# EasyEDA schematic Launchpad_2021-03-10.json
TITLE: Launchpad; REV: 1.0; Date: 2021-03-03; Sheet: 1/1; Drawn By: วิศรุต วงตา; Company: CYBMCYSSBSSNTMMC
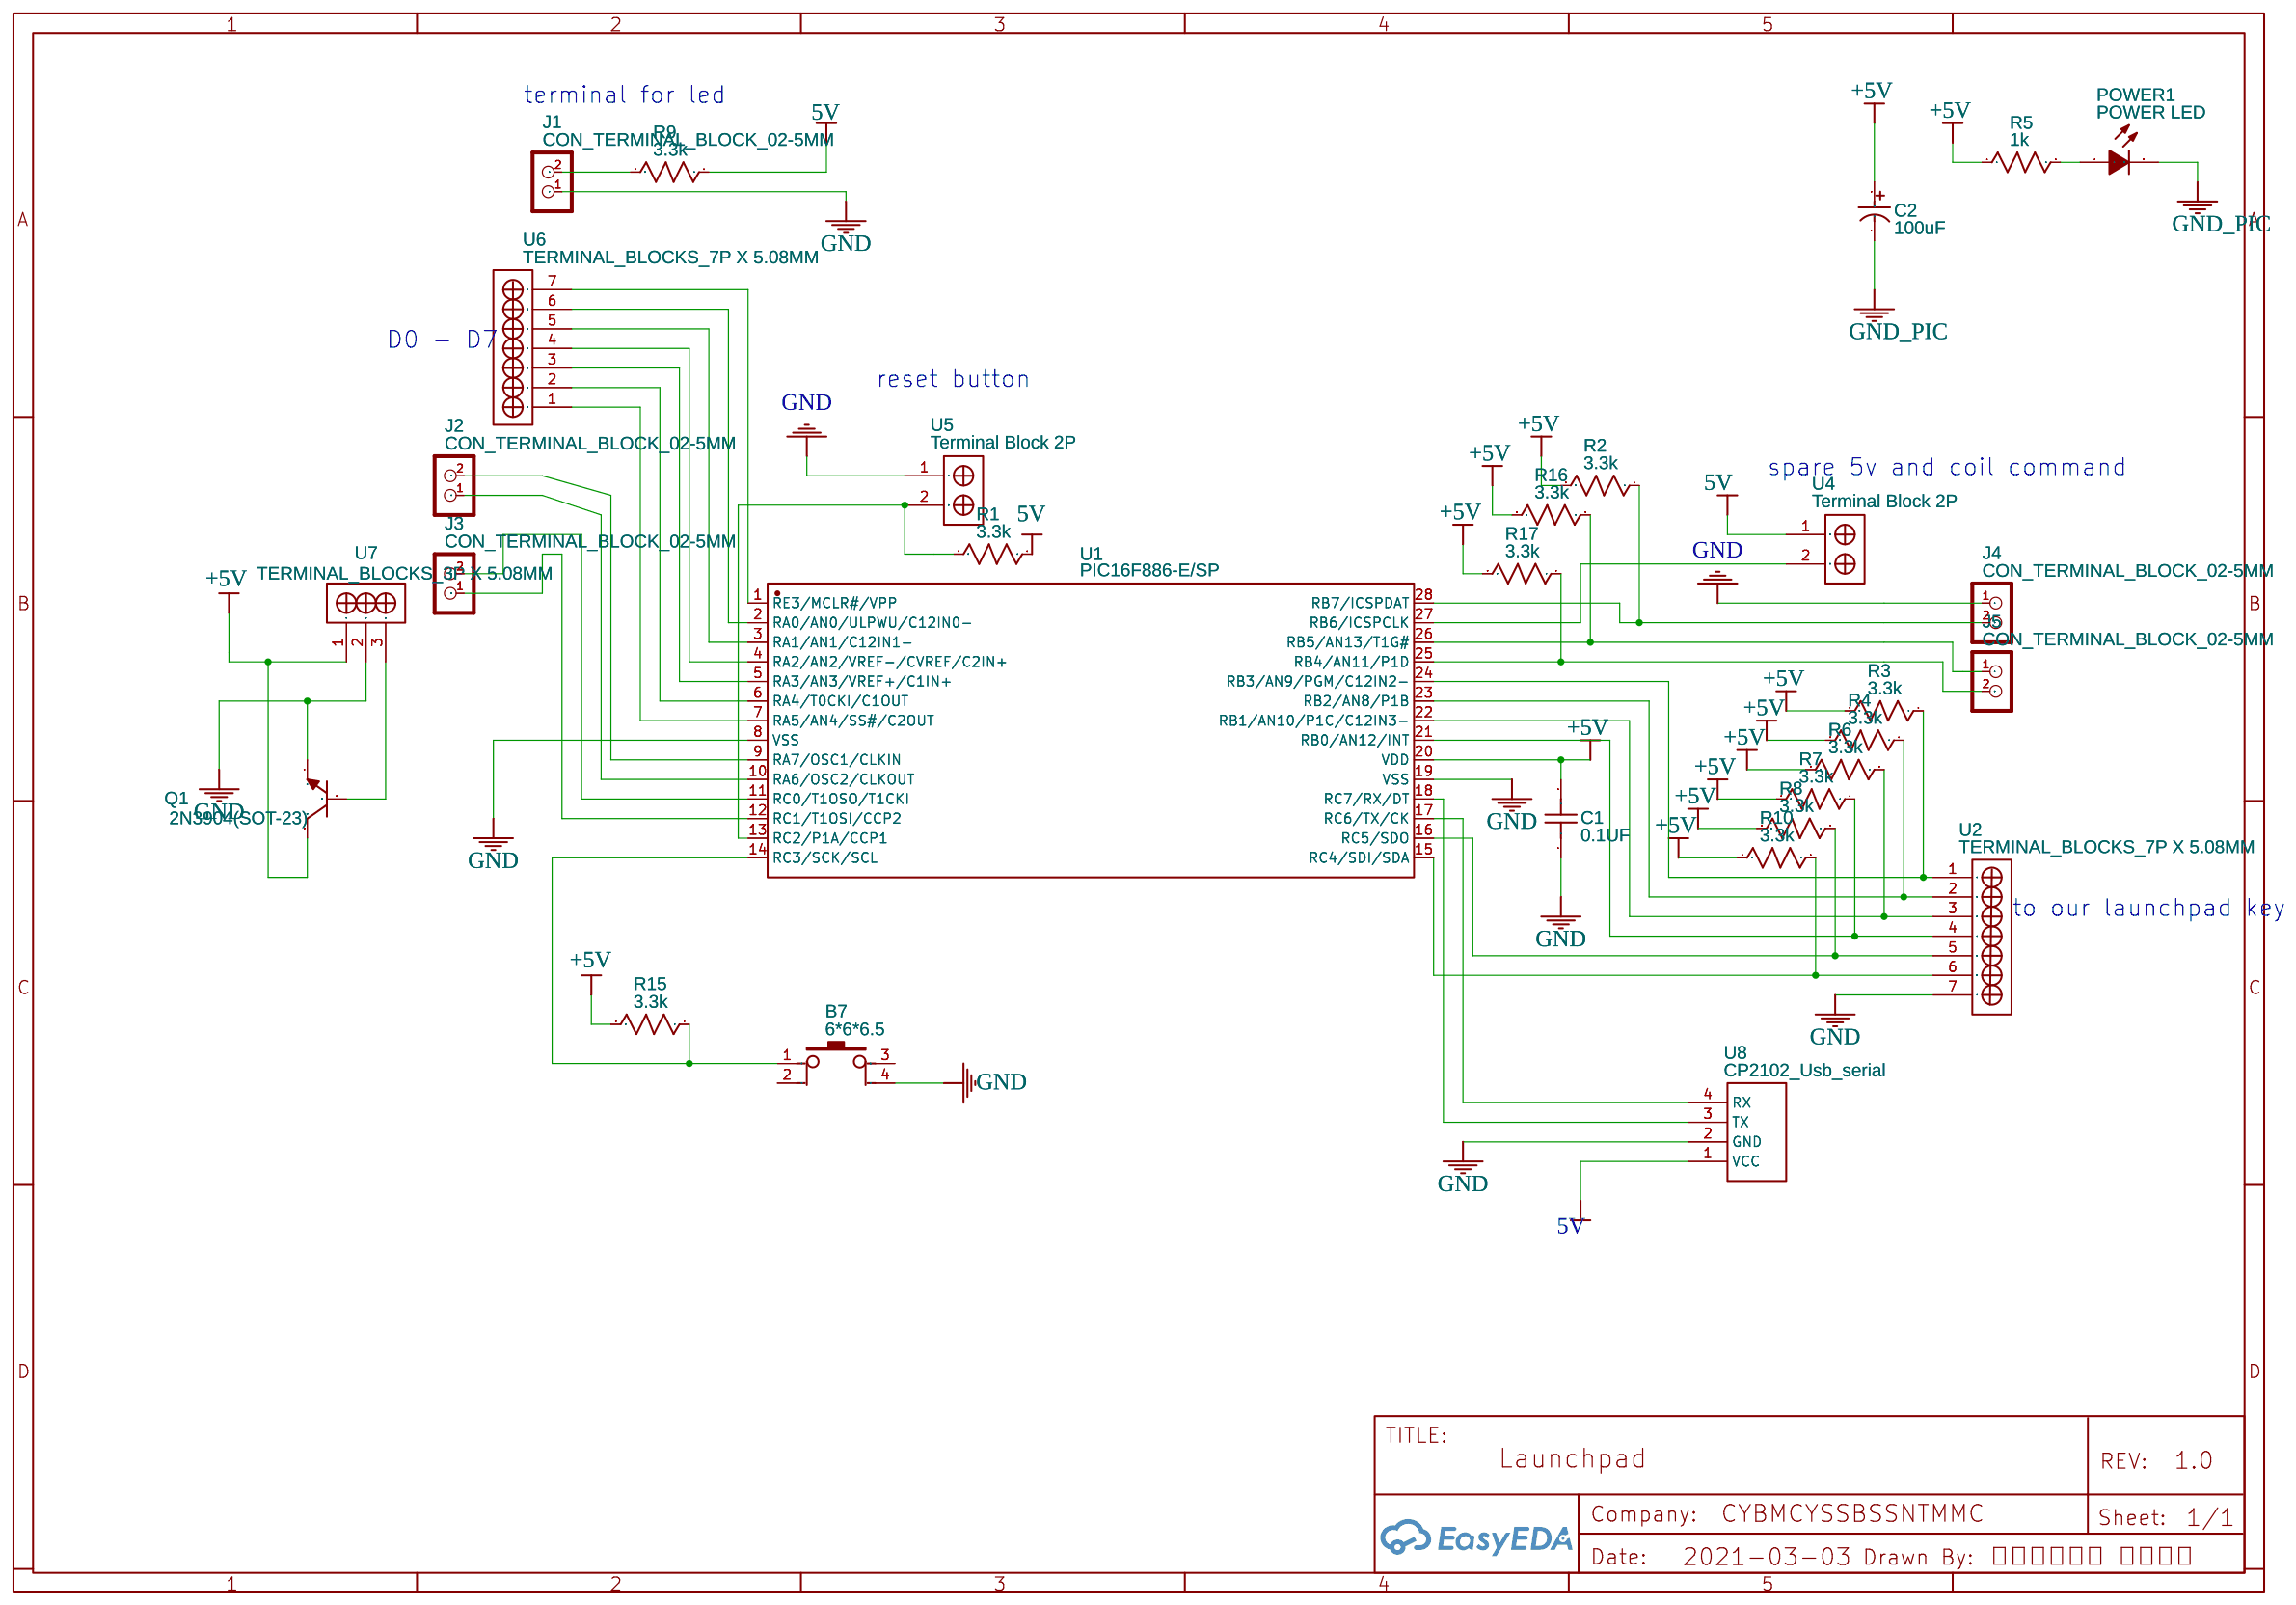
[diagram p0: schematic sheet]

## Parts
B7  6*6*6.5  [KEY-6.0*6.0-2]
C1  0.1UF  [RAD-0.2]
C2  100uF  [CAP-D5.0XF2.0]
J1  CON_TERMINAL_BLOCK_02-5MM  [TERMINAL_BLOCK_2P_5]
J2  CON_TERMINAL_BLOCK_02-5MM  [TERMINAL_BLOCK_2P_5]
J3  CON_TERMINAL_BLOCK_02-5MM  [TERMINAL_BLOCK_2P_5]
J4  CON_TERMINAL_BLOCK_02-5MM  [TERMINAL_BLOCK_2P_5]
J5  CON_TERMINAL_BLOCK_02-5MM  [TERMINAL_BLOCK_2P_5]
POWER1  POWER LED  [LED3MM]
Q1  2N3904(SOT-23)  [SOT-23-3_L2.9-W1.3-P1.90-LS2.4-TR]
R1  3.3k  [AXIAL-0.3]
R2  3.3k  [AXIAL-0.3]
R3  3.3k  [AXIAL-0.3]
R4  3.3k  [AXIAL-0.3]
R5  1k  [AXIAL-0.3]
R6  3.3k  [AXIAL-0.3]
R7  3.3k  [AXIAL-0.3]
R8  3.3k  [AXIAL-0.3]
R9  3.3k  [AXIAL-0.3]
R10  3.3k  [AXIAL-0.3]
R15  3.3k  [AXIAL-0.3]
R16  3.3k  [AXIAL-0.3]
R17  3.3k  [AXIAL-0.3]
U1  PIC16F886-E/SP  [SPDIP-28_L34.7-W7.5-P2.54-LS9.0-BL]
U2  TERMINAL_BLOCKS_7P X 5.08MM  [TERMINAL_BLOCKS_7P X 5.08MM]
U4  Terminal Block 2P  [TERMINAL BLOCK 2P]
U5  Terminal Block 2P  [TERMINAL BLOCK 2P]
U6  TERMINAL_BLOCKS_7P X 5.08MM  [TERMINAL_BLOCKS_7P X 5.08MM]
U7  TERMINAL_BLOCKS_3P X 5.08MM  [TERMINAL_BLOCKS_3P X 5.08MM]
U8  CP2102_Usb_serial  [WAVESHARE_USB_SERIAL]

## Library data of the parts
B7 = -: Supplier: LCSC; Manufacturer: BBJ; Manufacturer Part: 6*6*6.5Plastic head,260G, 0.25mm,Straight line; Supplier Part: C71841
C1 = 250V 0.1UF 5% CBBCapacitor: Supplier: LCSC; Manufacturer: ReliaPro; Supplier Part: C46804
C2 = 100uf/10V: Supplier: LCSC; Manufacturer: ValuePro; Supplier Part: C2035
J1-J5 = CON_TERMINAL_BLOCK_02-5MM: 2 poles wire to board terminal block; Contributor: DangerousPrototype
POWER1 = -: Supplier: LCSC; Manufacturer: KENTO; Manufacturer Part: φ3 Red; image: //image.lceda.cn/szlcsc/C39928.jpg; Supplier Part: C39928
Q1 = 2N3904(SOT-23): Supplier: LCSC; Manufacturer: KEC; Manufacturer Part: 2n3904S-RTK/PS; Supplier Part: C18536; SMT Type: SOT-23; Contributor: LCEDA_Lib
R1-R10 R15-R17 = Res_AXIAL-0.3(1/8W)_US: Manufacturer Part: ?
U1 = PIC16F886-E/SP: Supplier: LCSC; Supplier Part: C647573; Manufacturer: Microchip Tech; Contributor: LCSC
U2 U6 = TERMINAL_BLOCKS_7P X 5.08MM: Manufacturer Part: Terminal Block; Supplier Part: undefined; Contributor: Mertens
U4 U5 = Terminal Block 2P: Manufacturer Part: Terminal Block; Supplier Part: undefined; Contributor: Jomba
U7 = TERMINAL_BLOCKS_3P X 5.08MM: Manufacturer Part: Terminal Block; Supplier Part: undefined; Contributor: Mertens
U8 = CP2102_Usb_serial: Manufacturer: Waveshare; Supplier: Waveshare; Supplier Part: CP2102 USB UART Board (micro); Contributor: fordmercuryfan

## Nets
5V: R1.1 R9.1 U4.1 U8.1(VCC)
+5V: C1.2 C2.1 Q1.3(C) R2.2 R3.2 R4.2 R5.1 R6.2 R7.2 R8.2 R10.2 R15.2 R16.2 R17.2 U1.20(VDD) U7.1
GND: B7.4 C1.1 J1.1 J4.1 Q1.1(E) U1.8(VSS) U1.19(VSS) U2.7 U5.1 U7.2 U8.2(GND)
GND_PIC: C2.2 POWER1.2(C)
Net-(B7-1): B7.1 R15.1 U1.14(RC3/SCK/SCL)
Net-(J1-2): J1.2 R9.2
Net-(J2-1): J2.1 U1.10(RA6/OSC2/CLKOUT)
Net-(J2-2): J2.2 U1.9(RA7/OSC1/CLKIN)
Net-(J3-1): J3.1 U1.12(RC1/T1OSI/CCP2)
Net-(J3-2): J3.2 U1.11(RC0/T1OSO/T1CKI)
Net-(J4-2): J4.2 R2.1 U1.28(RB7/ICSPDAT)
Net-(J5-1): J5.1 R16.1 U1.26(RB5/AN13/T1G#)
Net-(J5-2): J5.2 R17.1 U1.25(RB4/AN11/P1D)
Net-(POWER1-1): POWER1.1(A) R5.2
Net-(Q1-2): Q1.2(B) U7.3
Net-(R1-2): R1.2 U1.13(RC2/P1A/CCP1) U5.2
Net-(R3-1): R3.1 U1.24(RB3/AN9/PGM/C12IN2-) U2.1
Net-(R4-1): R4.1 U1.23(RB2/AN8/P1B) U2.2
Net-(R6-1): R6.1 U1.22(RB1/AN10/P1C/C12IN3-) U2.3
Net-(R7-1): R7.1 U1.21(RB0/AN12/INT) U2.4
Net-(R8-1): R8.1 U1.16(RC5/SDO) U2.5
Net-(R10-1): R10.1 U1.15(RC4/SDI/SDA) U2.6
Net-(U1-1): U1.1(RE3/MCLR#/VPP) U6.7
Net-(U1-2): U1.2(RA0/AN0/ULPWU/C12IN0-) U6.6
Net-(U1-3): U1.3(RA1/AN1/C12IN1-) U6.5
Net-(U1-4): U1.4(RA2/AN2/VREF-/CVREF/C2IN+) U6.4
Net-(U1-5): U1.5(RA3/AN3/VREF+/C1IN+) U6.3
Net-(U1-6): U1.6(RA4/T0CKI/C1OUT) U6.2
Net-(U1-7): U1.7(RA5/AN4/SS#/C2OUT) U6.1
Net-(U1-17): U1.17(RC6/TX/CK) U8.4(RX)
Net-(U1-18): U1.18(RC7/RX/DT) U8.3(TX)
Net-(U1-27): U1.27(RB6/ICSPCLK) U4.2

Not connected (* = marked no-connect by the designer): B7 2 3

## Notes on the sheet
- terminal for led
- D0 - D7
- reset button
- spare 5v and coil command
- to our launchpad key
